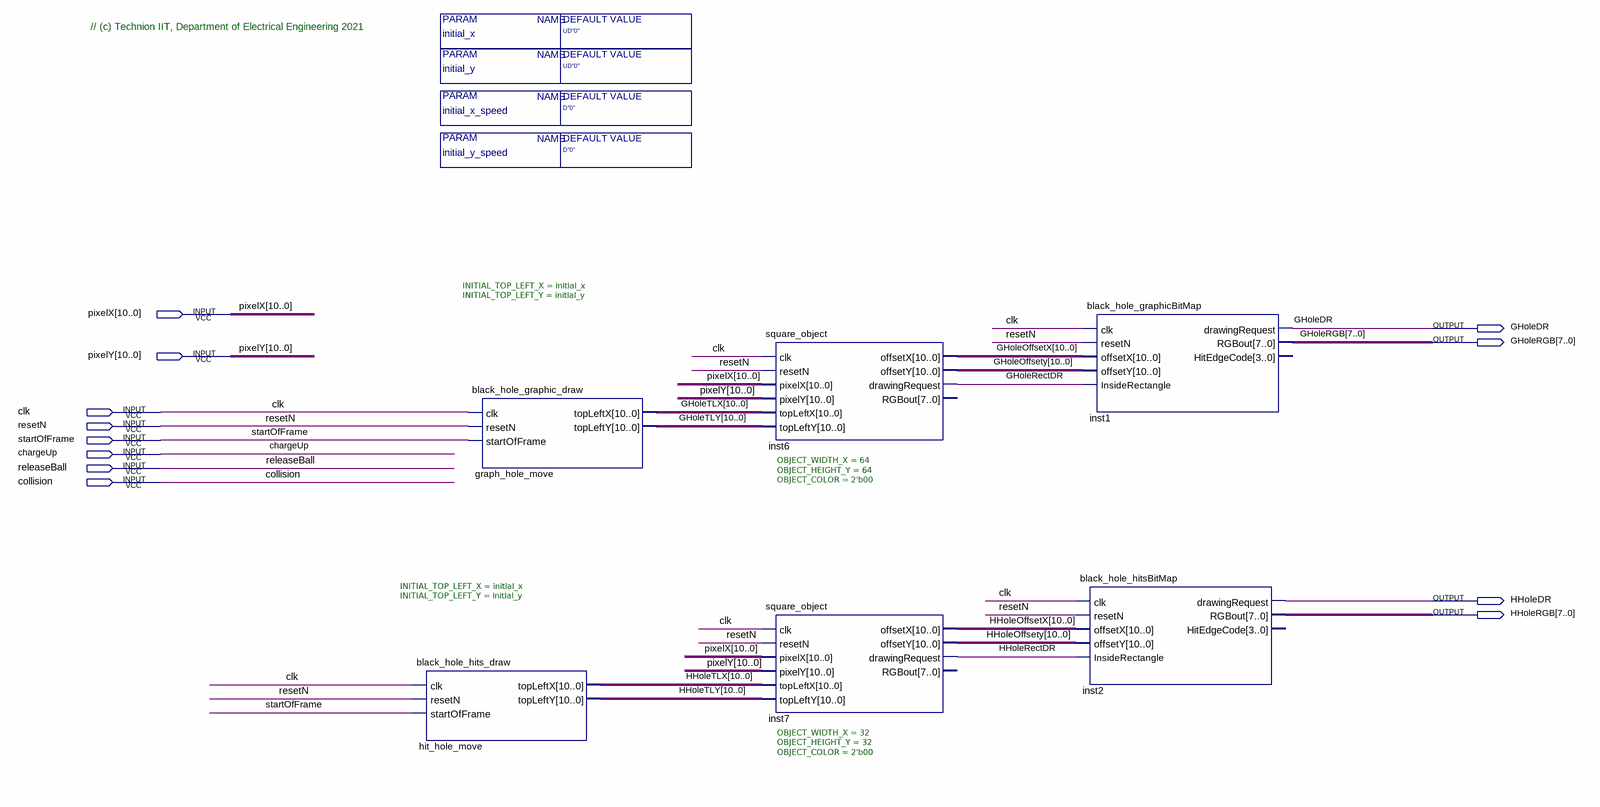
[diagram p0: schematic sheet]
// Quartus schematic black_hole_block.bdf as structural Verilog: 6 symbols, 12 pins
module black_hole_block #(parameter initial_x_speed = "D\"0\"", parameter initial_y_speed = "D\"0\"", parameter initial_x = "UD\"0\"", parameter initial_y = "UD\"0\"") (
  input  [10:0] pixelX,
  input  [10:0] pixelY,
  input  clk,
  input  resetN,
  input  startOfFrame,
  input  chargeUp,
  input  releaseBall,
  input  collision,
  output GHoleDR,
  output [7:0] GHoleRGB,
  output HHoleDR,
  output [7:0] HHoleRGB
);

  wire GHoleRectDR, HHoleRectDR;
  wire [10:0] GHoleOffsetX, GHoleOffsety, GHoleTLX, GHoleTLY, HHoleOffsetX, HHoleOffsety, HHoleTLX, HHoleTLY;

  black_hole_hits_draw #(.INITIAL_TOP_LEFT_X(initial_x), .INITIAL_TOP_LEFT_Y(initial_y)) hit_hole_move (
    .clk(clk), .resetN(resetN), .startOfFrame(startOfFrame), .topLeftX(HHoleTLX), .topLeftY(HHoleTLY));
  black_hole_graphic_draw #(.INITIAL_TOP_LEFT_X(initial_x), .INITIAL_TOP_LEFT_Y(initial_y)) graph_hole_move (
    .clk(clk), .resetN(resetN), .startOfFrame(startOfFrame), .topLeftX(GHoleTLX), .topLeftY(GHoleTLY));
  square_object #(.OBJECT_WIDTH_X(64), .OBJECT_HEIGHT_Y(64), .OBJECT_COLOR(2'b00)) inst6 (
    .clk(clk), .resetN(resetN), .pixelX(pixelX), .pixelY(pixelY), .topLeftX(GHoleTLX), .topLeftY(GHoleTLY),
    .offsetX(GHoleOffsetX), .offsetY(GHoleOffsety), .drawingRequest(GHoleRectDR));  // open: RGBout
  square_object #(.OBJECT_WIDTH_X(32), .OBJECT_HEIGHT_Y(32), .OBJECT_COLOR(2'b00)) inst7 (
    .clk(clk), .resetN(resetN), .pixelX(pixelX), .pixelY(pixelY), .topLeftX(HHoleTLX), .topLeftY(HHoleTLY),
    .offsetX(HHoleOffsetX), .offsetY(HHoleOffsety), .drawingRequest(HHoleRectDR));  // open: RGBout
  black_hole_graphicBitMap inst1 (
    .clk(clk), .resetN(resetN), .offsetX(GHoleOffsetX), .offsetY(GHoleOffsety),
    .InsideRectangle(GHoleRectDR), .drawingRequest(GHoleDR), .RGBout(GHoleRGB));  // open: HitEdgeCode
  black_hole_hitsBitMap inst2 (
    .clk(clk), .resetN(resetN), .offsetX(HHoleOffsetX), .offsetY(HHoleOffsety),
    .InsideRectangle(HHoleRectDR), .drawingRequest(HHoleDR), .RGBout(HHoleRGB));  // open: HitEdgeCode

  // Notes on the sheet:
  //   // (c) Technion IIT, Department of Electrical Engineering 2021
endmodule
